# EAGLE design wemos-d1-screw-terminal-v1.0 (EAGLE 9.6.2)
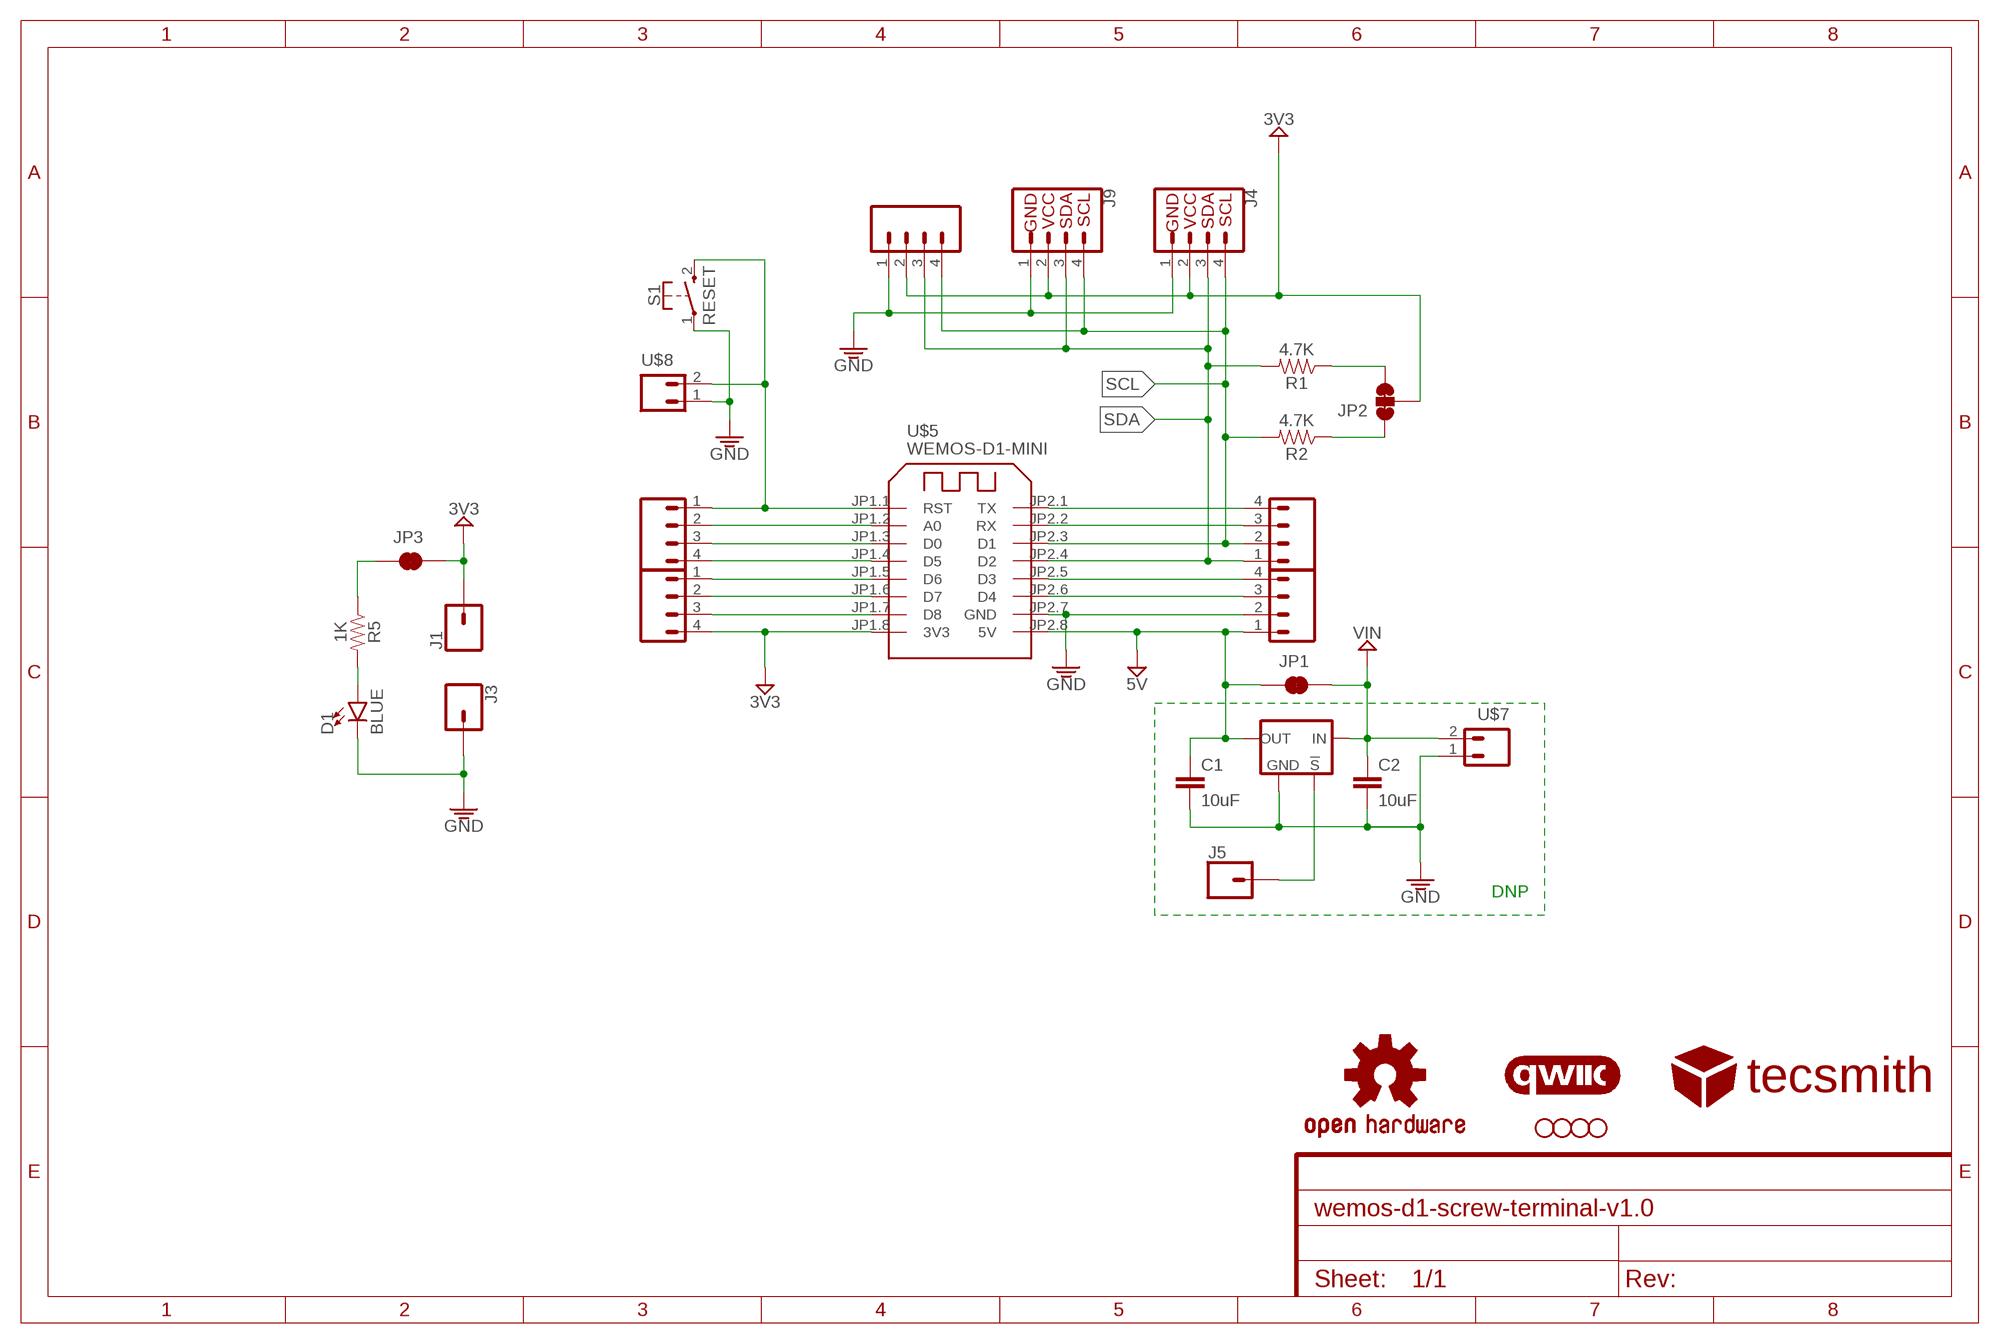
[diagram p0: schematic, sheet 1]

## Parts
C1  10uF  10UF-0805-10V-10%  [0805]
C2  10uF  10UF-0805-10V-10%  [0805]
D1  BLUE  LED-BLUE0603  [LED-0603]
H1  STAND-OFF  [STAND-OFF]
H2  STAND-OFF  [STAND-OFF]
H5  STAND-OFF  [STAND-OFF]
H6  STAND-OFF  [STAND-OFF]
J1  CONN_01PTH_NO_SILK_YES_STOP  [1X01_NO_SILK]
J2  CONN_04PTH  [1X04]
J3  CONN_01PTH_NO_SILK_YES_STOP  [1X01_NO_SILK]
J4  QWIIC_RIGHT_ANGLE  QWIIC_CONNECTORJS-1MM  [JST04_1MM_RA]
J5  CONN_01PTH_NO_SILK_YES_STOP  [1X01_NO_SILK]
J9  QWIIC_RIGHT_ANGLE  QWIIC_CONNECTORJS-1MM  [JST04_1MM_RA]
JP1  JUMPER-COMBO_2_NC_TRACE  [COMBO-JUMPER_2_NC_TRACE]
JP2  JUMPER-SMT_3_2-NC_TRACE_SILK  [SMT-JUMPER_3_2-NC_TRACE_SILK]
JP3  JUMPER-SMT_2_NC_TRACE_SILK  [SMT-JUMPER_2_NC_TRACE_SILK]
LOGO1  OSHW-LOGOS  [OSHW-LOGO-S]
LOGO2  QWIIC_LOGO_6MM  [QWIIC_6MM]
R1  4.7K  RESISTOR0805  [0805]
R2  4.7K  RESISTOR0805  [0805]
R5  1K  330OHM-0603-1/10W-1%  [0603]
S1  RESET  MOMENTARY-SWITCH-SPST-1  [SKRKAEE020]
U$1  CON_04SCREW  [WURTH_2431_3.5MM_4X_SCREW]
U$2  CON_04SCREW  [WURTH_2431_3.5MM_4X_SCREW]
U$3  CON_04SCREW  [WURTH_2431_3.5MM_4X_SCREW]
U$4  CON_04SCREW  [WURTH_2431_3.5MM_4X_SCREW]
U$5  WEMOS-D1-MINI  [WEMOS-D1-MINI]
U$6  POLOLU-VREG  [TO-220+1]
U$7  CON_02SCREW  [WURTH_2431_3.5MM_2X_SCREW]
U$8  JST-PH-2  [JST-PH2]
U$9  TECSMITH-LOGO  [TECSMITH-LOGO]

## Nets
GND: C1.2 C2.2 D1.C J2.1 J3.1 J4.1 J9.1 S1.1 U$3.2 U$5.JP2.7(GND) U$6.GND U$7.1 U$8.1
N$1: S1.2 U$1.1 U$5.JP1.1(RST) U$8.2
N$2: U$1.2 U$5.JP1.2(A0)
N$3: U$1.3 U$5.JP1.3(D0)
N$4: U$1.4 U$5.JP1.4(D5)
N$5: U$2.1 U$5.JP1.5(D6)
N$6: D1.A R5.2
N$7: U$2.2 U$5.JP1.6(D7)
N$8: U$2.3 U$5.JP1.7(D8)
N$9: JP3.1 R5.1
N$10: U$4.4 U$5.JP2.1(TX)
N$11: U$4.3 U$5.JP2.2(RX)
N$12: J5.1 U$6.!SHDN
N$14: U$3.4 U$5.JP2.5(D3)
N$15: U$3.3 U$5.JP2.6(D4)
N$16: JP2.1 R2.1
N$17: JP2.3 R1.1
SCL: J2.4 J4.4 J9.4 R2.2 U$4.2 U$5.JP2.3(D1)
SDA: J2.3 J4.3 J9.3 R1.2 U$4.1 U$5.JP2.4(D2)
VCC: J1.1 J2.2 J4.2 J9.2 JP2.2 JP3.2 U$2.4 U$5.JP1.8(3V3) ; supply symbol labelled 3V3
VCC_1: C1.1 JP1.1 JP1.3 U$3.1 U$5.JP2.8(5V) U$6.OUT ; supply symbol labelled 5V
VCC_2: C2.1 JP1.2 JP1.4 U$6.IN U$7.2 ; supply symbol labelled VIN

## Notes on the sheet
- DNP

## Library data of the parts
C1 C2 = SparkFun-Capacitors:10UF: 10.0µF ceramic capacitors A capacitor is a passive two-terminal electrical component used to store electrical energy temporarily in an electric field.; PROD_ID: CAP-11330
D1 = SparkFun-LED:LED-BLUE: Blue SMD LED Used in manufacturing of various products at SparkFun Packages: 0603 - SMD 0603 package [Product Link] <http://www.digikey.com/product-detail/en/SMLE12BC7TT86/511-1589-2-ND/1641808> 1206 - SMD1206 package [Product Link] <http://www.digikey.com/product-detail/en/lite-on-inc/LTST-C150TBKT/160-1643-1-ND/573584> SparkFun Products: ESP8266 Thing-Dev Board <https://www.sparkfun.com/products/13711> RedBoard <https://www.sparkfun.com/products/12757>; PROD_ID: DIO-08575
H1 H2 H5 H6 = SparkFun-Hardware:STAND-OFF: Stand Off Drill holes for mechanically mounting via screws, standoffs, etc. Note: Use the keepout ring to avoid running the screw head into surrounding components. Variant Overviews STAND-OFF - Mechanical footprint for a #4 phillips button head screw. STAND-OFF-TIGHT - Mechanical footprint for a #4 phillips button head screw, Example SparkFun Products Screw - Phillips Head (1/4", 4-40, 10 pack) <https://www.sparkfun.com/products/10453> (PRT-10453) Screw - Phillips Head (1/2", 4-40, 10 pack) <https://www.sparkfun.com/products/10452> (PRT-10452) Screw - Phillips Head (3/4", 4-40, 10 pack) <https://www.sparkfun.com/products/10451> (PRT-10451) Screw - Phillips Head (1", 4-40, 10 pack) <https://www.sparkfun.com/products/10450> (PRT-10450)
J1 J3 J5 = SparkFun-Connectors:CONN_01: Single connection point. Often used as Generic Header-pin footprint for 0.1 inch spaced/style header connections On any of the 0.1 inch spaced packages, you can populate with these: Break Away Headers - Straight <https://www.sparkfun.com/products/116> (PRT-00116) Break Away Male Headers - Right Angle <https://www.sparkfun.com/products/553> (PRT-00553) Female Headers <https://www.sparkfun.com/products/115> (PRT-00115) Break Away Headers - Machine Pin <https://www.sparkfun.com/products/117> (PRT-00117) Break Away Female Headers - Swiss Machine Pin <https://www.sparkfun.com/products/743> (PRT-00743) This device is also useful as a general connection point to wire up your design to another part of your project. Our various solder wires solder well into these plated through hole pads. Hook-Up Wire - Assortment (Stranded, 22 AWG) <https://www.sparkfun.com/products/11375> (PRT-11375) Hook-Up Wire - Assortment (Solid Core, 22 AWG) <https://www.sparkfun.com/products/11367> (PRT-11367) View the entire wire category on our website here <https://www.sparkfun.com/categories/141> Special notes: SMTSO-256-ET is a "flush mount" nut for a 4-40 screw. We mostly use this on specialty testbeds; it is a nice way to connect hardware to your PCB at an adjustable hieght. Also note, the SNAP packages are for using a snappable style connector. We sell a baggie of snaps and they are also used on two LilyPad designs: Snap Assortment - 30 pack (male and female) <https://www.sparkfun.com/products/11347> (DEV-11347) LilyPad Arduino SimpleSnap <https://www.sparkfun.com/products/10941> (DEV-10941) LilyPad SimpleSnap Protoboard <https://www.sparkfun.com/products/10940> (DEV-10940)
J2 = SparkFun-Connectors:CONN_04: Multi connection point. Often used as Generic Header-pin footprint for 0.1 inch spaced/style header connections On any of the 0.1 inch spaced packages, you can populate with these: Break Away Headers - Straight <https://www.sparkfun.com/products/116> (PRT-00116) Break Away Male Headers - Right Angle <https://www.sparkfun.com/products/553> (PRT-00553) Female Headers <https://www.sparkfun.com/products/115> (PRT-00115) Break Away Headers - Machine Pin <https://www.sparkfun.com/products/117> (PRT-00117) Break Away Female Headers - Swiss Machine Pin <https://www.sparkfun.com/products/743> (PRT-00743) For SCREWTERMINALS and SPRING TERMINALS visit here: Screw Terimnals on SparkFun.com <https://www.sparkfun.com/search/results?term=Screw+Terminals> (5mm/3.5mm/2.54mm spacing) This device is also useful as a general connection point to wire up your design to another part of your project. Our various solder wires solder well into these plated through hole pads. Hook-Up Wire - Assortment (Stranded, 22 AWG) <https://www.sparkfun.com/products/11375> (PRT-11375) Hook-Up Wire - Assortment (Solid Core, 22 AWG) <https://www.sparkfun.com/products/11367> (PRT-11367) View the entire wire category on our website here <https://www.sparkfun.com/categories/141> Special notes: Molex polarized connector foot print use with SKU : PRT-08231 with associated crimp pins and housings. 1MM SMD Version SKU: PRT-10208; PROD_ID: CONN-09696
J4 J9 = SparkFun-Connectors:QWIIC_CONNECTOR: SparkFun I2C Standard Qwiic Connector An SMD 1mm pitch JST connector makes it easy and quick (get it? Qwiic?) to connect I2C devices to each other. The Qwiic system <http://www.sparkfun.com/qwiic> enables fast and solderless connection between popular platforms and various sensors and actuators. We carry 200mm <https://www.sparkfun.com/products/14204>, 100mm <https://www.sparkfun.com/products/14205>, 50mm <https://www.sparkfun.com/products/14206>, and breadboard friendly <https://www.sparkfun.com/products/14207> Qwiic cables. We also offer 10 pcs strips <https://www.sparkfun.com/products/14323> the SMD connectors.; PROD_ID: CONN-13694
JP1 = SparkFun-Jumpers:JUMPER-COMBO_2_NC_TRACE
JP2 = SparkFun-Jumpers:JUMPER-SMT_3_2-NC_TRACE: Normally closed trace jumper (2 of 2 connections) This jumper has a trace between all three pads so they are normally closed (NC). Use a razor knife to open the connection(s). For best results follow the IPC guidelines for cutting traces: Cutout at least 0.063 mm (0.005 in). Remove all loose material to clean up the cut area. Seal the cut with an approved epoxy. Reapply solder to reclose the connection(s).
JP3 = SparkFun-Jumpers:JUMPER-SMT_2_NC_TRACE: Normally closed trace jumper This jumper has a trace between two pads so it's normally closed (NC). Use a razor knife to open the connection. For best results follow the IPC guidelines for cutting traces: Cutout at least 0.063 mm (0.005 in). Remove all loose material to clean up the cut area. Seal the cut with an approved epoxy. Reapply solder to reclose the connection.
LOGO1 = SparkFun-Aesthetics:OSHW-LOGO: Open-Source Hardware (OSHW) Logo This logo indicates the piece of hardware it is found on incorporates a OSHW license and/or adheres to the definition of open source hardware found here: http://freedomdefined.org/OSHW
LOGO2 = SparkFun-Aesthetics:QWIIC_LOGO: Qwiic Logos for placement on schematic and PCB. The 5.5mm silk logo is best for placing next to Qwiic connector.
R1 R2 = SparkFun-Resistors:RESISTOR: Generic Resistor Package
R5 = SparkFun-Resistors:330OHM: 330Ω resistor A resistor is a passive two-terminal electrical component that implements electrical resistance as a circuit element. Resistors act to reduce current flow, and, at the same time, act to lower voltage levels within circuits. - Wikipedia; PROD_ID: RES-00818; VALUE: 330
S1 = VinoRodrigues_Custom_Eagle:MOMENTARY-SWITCH-SPST-1: Momentary Switch (Pushbutton) - SPST - Two Circuits Normally-open (NO) SPST momentary switches (buttons, pushbuttons). Schematic symbol includes two switch circuits. Variants SMD-4.6MMX2.8MM - 4.60mm x 2.80mm Tactile Momentary Button Switch - Used on SparkFun SAMD21 Mini Breakout <https://www.sparkfun.com/products/13664> SMD-5.2MM - Mini Pushbutton Switch - SMD <https://www.sparkfun.com/products/8720> - Used on Arduino Pro Mini <https://www.sparkfun.com/products/11114>
U$1-U$4 = VinoRodrigues_Custom_Eagle:CON_04SCREW
U$5 = VinoRodrigues_Custom_Eagle:WEMOS-D1-MINI: WEMOS D1 mini: Mini Wi-Fi Board based on ESP-8266 device More details can be found here: https://www.wemos.cc/product/d1-mini.html
U$6 = VinoRodrigues_Custom_Eagle:POLOLU-VREG
U$7 = VinoRodrigues_Custom_Eagle:CON_02SCREW
U$8 = VinoRodrigues_Custom_Eagle:JST-PH-2
U$9 = VinoRodrigues_Custom_Eagle:TECSMITH-LOGO

## Board
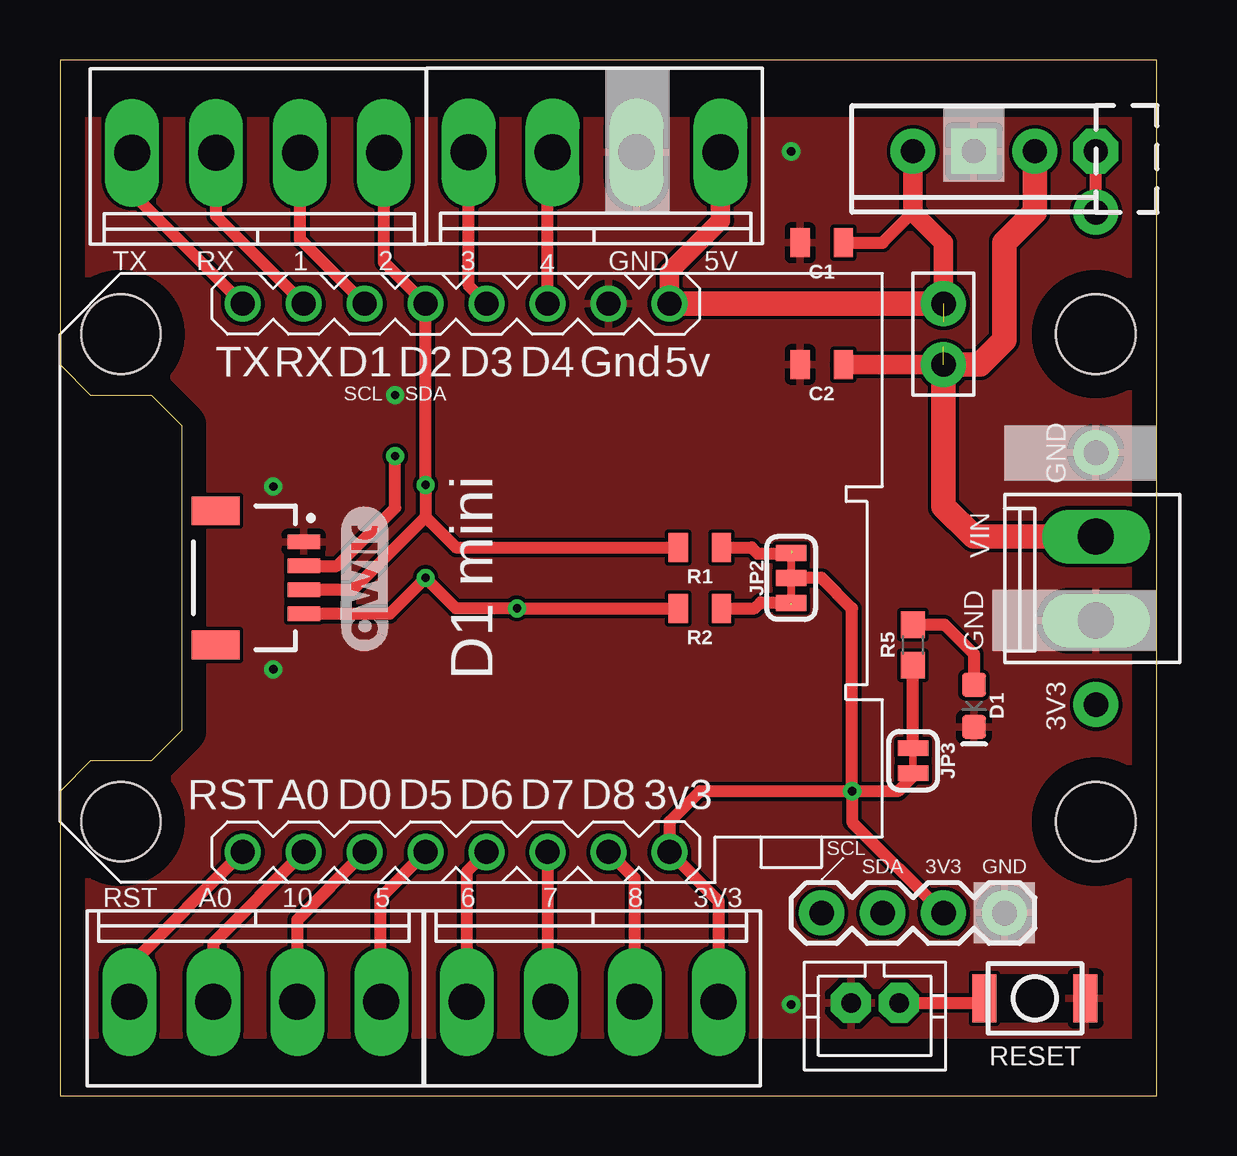
[diagram p1: board, top side]
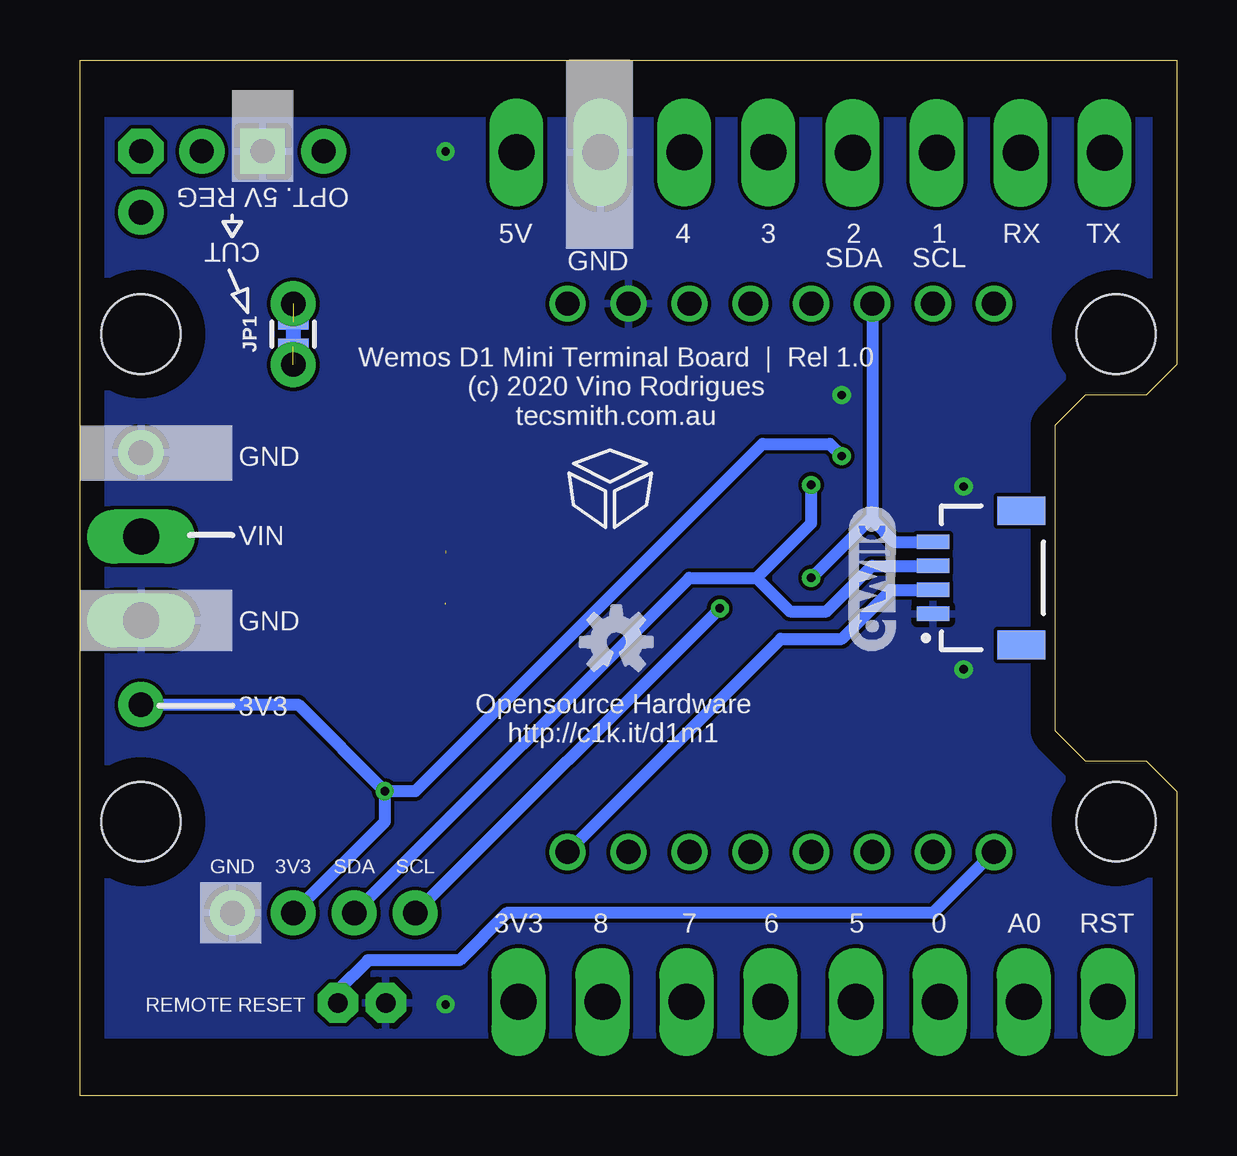
[diagram p2: board, bottom side, seen from below]

Size 45.72 x 43.18 mm. Coordinates in mm from the lower left corner, seen from the top.
Outline: 0,0 45.72,0 45.72,43.18 0,43.18 0,30.48 1.27,29.21 3.81,29.21 5.08,27.94 5.08,15.24 3.81,13.97 1.27,13.97 0,12.7 0,0
Copper layers (1*16): Top 0.035mm / dielectric 1.5mm / Bottom 0.035mm
Design rules "default": minimum track width 6mil, minimum drill 0.35mm, track to track 6mil, track to pad 6mil, pad to pad 6mil, via to via 6mil, smd to smd 6mil, copper to edge 40mil, drill to drill 6mil, minimum pad ring 10mil, minimum via ring 8mil, stop-mask expansion 4mil, vias tented up to drill 0mil, thermal gap 10mil

### Footprints (pad centres in the part's own frame; a part is rotated, then mirrored left to right if it is on the bottom)
0805 = smd 0.8 x 1.2: 1 -0.9,0; 2 0.9,0
LED-0603 = smd 1 x 1: A -0.877,0; C 0.877,0
STAND-OFF = hole 3.302: 0,0
1X01_NO_SILK = drill 1.016 pad 1.88: 1 0,0
1X04 = drill 1.016 pad 1.88: 1 0,0; 2 2.54,0; 3 5.08,0; 4 7.62,0
JST04_1MM_RA = smd 0.6 x 1.35: 1 -1.5,0; 2 -0.5,0; 3 0.5,0; 4 1.5,0 | smd 1.2 x 2: NC1 2.8,-3.675; NC2 -2.8,-3.675
COMBO-JUMPER_2_NC_TRACE = smd 0.635 x 1.27: 1 -0.508,0; 2 0.508,0 | drill 1.016 pad 1.88: 3 -1.27,0; 4 1.27,0
SMT-JUMPER_3_2-NC_TRACE_SILK = smd 0.66 x 1.27: 1 -1.041,0; 2 0,0; 3 1.041,0
SMT-JUMPER_2_NC_TRACE_SILK = smd 0.66 x 1.27: 1 -0.521,0; 2 0.521,0
0603 = smd 1.1 x 1: 1 -0.85,0; 2 0.85,0
SKRKAEE020 = smd 1 x 2: 1 -2.1,0; 2 2.1,0
WURTH_2431_3.5MM_4X_SCREW = drill 1.5 long: 1 0,0; 2 3.5,0; 3 7,0; 4 10.5,0
WEMOS-D1-MINI = drill 1: JP1.1 -11.43,9.525; JP1.2 -11.43,6.985; JP1.3 -11.43,4.445; JP1.4 -11.43,1.905; JP1.5 -11.43,-0.635; JP1.6 -11.43,-3.175; JP1.7 -11.43,-5.715; JP1.8 -11.43,-8.255; JP2.1 11.43,9.525; JP2.2 11.43,6.985; JP2.3 11.43,4.445; JP2.4 11.43,1.905; JP2.5 11.43,-0.635; JP2.6 11.43,-3.175; JP2.7 11.43,-5.715; JP2.8 11.43,-8.255
TO-220+1 = drill 1 pad 1.88 octagon: !SHDN -5.08,0 | drill 1 pad 1.88 square: GND 0,0 | drill 1 pad 1.88: IN -2.54,0; OUT 2.54,0
WURTH_2431_3.5MM_2X_SCREW = drill 1.5 long: 1 0,0; 2 3.5,0
JST-PH2 = drill 0.813 pad 1.676 octagon: 1 1,0; 2 -1,0

### Placement (x,y rotation side)
C1  31.75,35.56 180 top
C2  31.75,30.48 180 top
D1  38.1,16.26 270 top
H1  2.54,31.75 0 top
H2  43.18,31.75 0 top
H5  2.54,11.43 0 top
H6  43.18,11.43 0 top
J1  43.18,16.31 0 top
J2  39.37,7.62 180 top
J3  43.18,26.81 0 top
J4  10.16,21.59 90 bottom
J5  43.18,36.83 0 top
J9  10.16,21.59 270 top
JP1  36.83,31.75 270 bottom
JP2  30.48,21.59 90 top
JP3  35.56,13.97 270 top
LOGO1  23.37,18.92 0 bottom
LOGO2  12.7,21.59 90 top
LOGO3  QWIIC_LOGO_6MM  [QWIIC_6MM]  12.7,21.59 90 bottom
R1  26.67,22.86 180 top
R2  26.67,20.32 180 top
R5  35.56,18.8 90 top
S1  40.64,4.06 180 top
U$1  2.89,3.91 0 top
U$2  16.95,3.91 0 top
U$3  27.53,39.33 180 top
U$4  13.51,39.31 180 top
U$5  17.14,21.59 90 top
U$6  38.1,39.37 180 top
U$7  43.18,19.81 90 top
U$8  33.97,3.87 180 top
U$9  23.62,25.4 0 bottom

### Tracks (layer width: path | path; a pad name or v marks a point on that pad's centre or on a via)
GND  (via drill 0.35)
  other vias: 13.97,29.21 30.48,39.37 8.89,25.4 8.89,17.78 30.48,3.81
  pour Bottom: 0,2.54 45.72,2.54 45.72,40.64 0,40.64 0,30.48 1.27,29.21 3.81,29.21 5.08,27.94 5.08,15.24 3.81,13.97 1.27,13.97 0,12.7
  pour Top: 0,2.54 45.72,2.54 45.72,40.64 0,40.64 0,30.48 1.27,29.21 3.81,29.21 5.08,27.94 5.08,15.24 3.81,13.97 1.27,13.97 0,12.7
N$1
  Top 0.508: U$5.JP1.1 2.89,5.43 U$1.1 | U$8.2 38.35,3.87 S1.2
  Bottom 0.508: U$5.JP1.1 10.16,7.62 27.94,7.62 29.91,5.65 33.72,5.65 34.97,4.4 U$8.2
N$2
  Top 0.508: U$5.JP1.2 6.39,6.39 U$1.2
N$3
  Top 0.508: U$5.JP1.3 9.89,7.35 U$1.3
N$4
  Top 0.508: U$5.JP1.4 13.34,8.26 13.34,3.96 U$1.4
N$5
  Top 0.508: U$5.JP1.5 16.95,9.33 U$2.1
N$6
  Top 0.508: 35.59,19.65 R5.2 36.87,19.65 38.1,18.41 D1.A
N$7
  Top 0.508: U$5.JP1.6 20.32,4.04 U$2.2
N$8
  Top 0.508: U$5.JP1.7 23.95,9.07 U$2.3
N$9
  Top 0.508: JP3.1 R5.1
N$10
  Top 0.508: U$5.JP2.1 3.01,37.63 U$4.4
N$11
  Top 0.508: U$5.JP2.2 6.51,36.67 U$4.3
N$12
  Top 0.508: J5.1 U$6.!SHDN
N$14
  Top 0.508: U$5.JP2.5 17.03,33.77 U$3.4
N$15
  Top 0.508: U$5.JP2.6 20.32,39.12 U$3.3
N$16  (1 unrouted)
  Top 0.508: 30.48,20.47 30.18,20.47 30.08,20.57 29.21,20.57 28.96,20.32 R2.1
N$17  (1 unrouted)
  Top 0.508: R1.1 28.83,22.86 29.08,22.61 30.08,22.61 30.18,22.71 30.48,22.71
SCL  (via drill 0.35)
  Top 0.508: U$5.JP2.3 10.01,35.71 U$4.2 | J9.4 13.74,20.09 v15.24,21.59 16.51,20.32 v19.05,20.32 R2.2
  Bottom 0.508: J2.4 v19.05,20.32 | v15.24,21.59 12.7,24.13 | U$5.JP2.3 12.7,24.13 | 12.7,24.13 12.7,24 11.79,23.09 J4.4
SDA  (via drill 0.35)
  Top 0.508: U$4.1 13.51,34.75 U$5.JP2.4 v15.24,25.46 15.24,24.13 | 15.24,24.13 12.2,21.09 J9.3 | 15.24,24.13 16.51,22.86 R1.2
  Bottom 0.508: J2.3 20.32,21.59 17.53,21.59 | J4.3 12.71,22.09 14.61,20.19 16.13,20.19 17.53,21.59 | 17.53,21.59 15.24,23.88 v15.24,25.46
VCC  (via drill 0.35)
  Top 0.508: U$2.4 27.45,8.11 U$5.JP1.8 25.4,11.43 26.67,12.7 v33.02,12.7 | J9.2 11.55,22.09 13.97,24.51 v13.97,26.67 | JP2.2 31.75,21.59 33.02,20.32 v33.02,12.7 | v33.02,12.7 33.02,11.43 J2.2 | JP3.2 35.56,13.34 34.92,12.7 v33.02,12.7
  Bottom 0.508: U$5.JP1.8 16.51,19.05 13.97,19.05 11.93,21.09 J4.2 | v13.97,26.67 14.48,27.18 17.27,27.18 31.75,12.7 v33.02,12.7 | J2.2 33.02,11.43 v33.02,12.7 | v33.02,12.7 36.63,16.31 J1.1
VCC_1  (1 unrouted)
  Top 0.508: C1.1 34.29,35.56 35.56,36.83
  Top 0.813: 35.52,39.33 U$6.OUT 35.56,36.83 36.83,35.56 JP1.3 | U$5.JP2.8 25.4,34.35 27.53,36.49 U$3.1
  Top 1.016: U$5.JP2.8 JP1.3
VCC_2  (1 unrouted)
  Top 0.813: C2.1 JP1.4
  Top 1.016: U$6.IN 40.64,36.83 39.37,35.56 39.37,31.5 38.35,30.48 JP1.4 36.83,24.57 38.09,23.31 U$7.2

### Text on the board
bPlace: Wemos D1 Mini Terminal Board | Rel 1.0 / (c) 2020 Vino Rodrigues / tecsmith.com.au | Opensource Hardware / http://c1k.it/d1m1
tNames: TX | RX | 1 | 2 | 3 | 4 | GND | 5V | SCL | SDA | GND | VIN | GND | 3V3 | SCL | SDA | 3V3 | GND | RST | A0 | 10 | 5 | 6 | 7 | 8 | 3V3 | RESET
bNames: OPT. 5V REG | TX | RX | 1 | 2 | 3 | 4 | 5V | CUT | SCL | SDA | GND | GND | VIN | GND | 3V3 | SCL | SDA | 3V3 | GND | RST | A0 | 0 | 5 | 6 | 7 | 8 | 3V3 | REMOTE RESET